# Altium schematic sheet Top.SchDoc
size A4; SheetNumber: 1; SheetTotal: 5
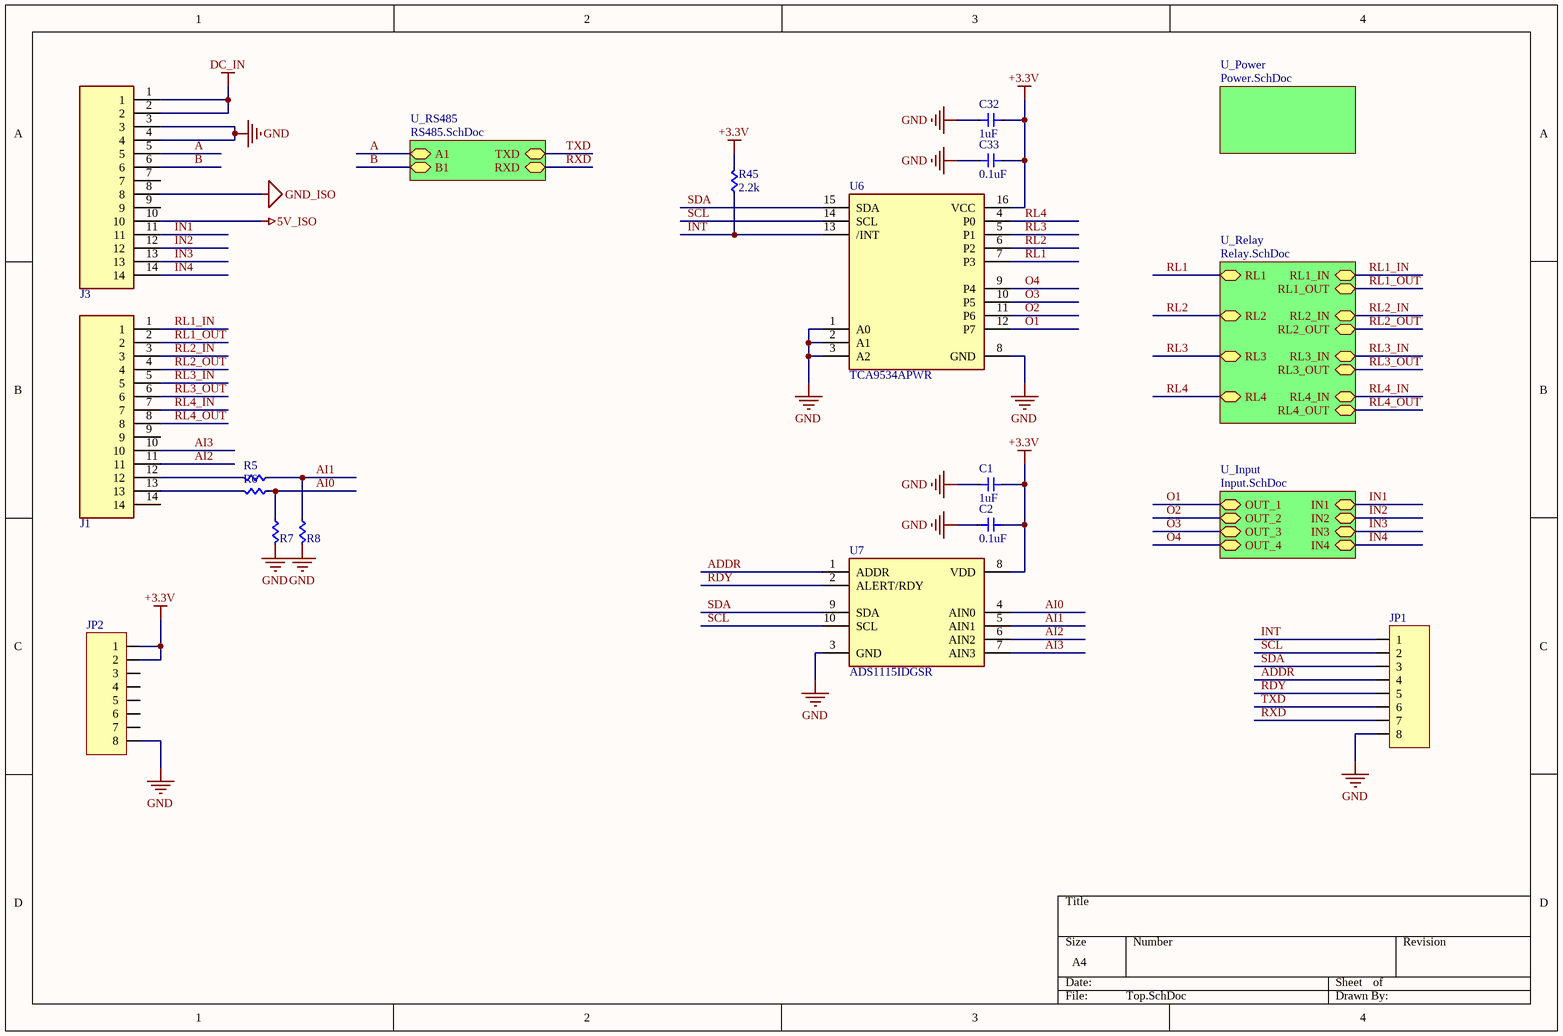
[diagram p0: Top.SchDoc]

## Parts
C1  1uF  [Cap 0603]
C2  0.1uF  [Cap 0603]
C32  1uF  [Cap 0603]
C33  0.1uF  [Cap 0603]
J1  CON 14 EDGR 3.81 RA  [CON 14 EDGR 3.81 RA]  (value not drawn)
J3  CON 14 EDGR 3.81 RA  [CON 14 EDGR 3.81 RA]  (value not drawn)
JP1  JP 1x8 2.54  [JP 1x8 DT]  (value not drawn)
JP2  JP 1x8 2.54  [JP 1x8 DT]  (value not drawn)
R5  RS1  [RES 0603]  (value not drawn)
R6  RS1  [RES 0603]  (value not drawn)
R7  RS2  [RES 0603]  (value not drawn)
R8  RS2  [RES 0603]  (value not drawn)
R45  2.2k  [RES 0603]
U6  TCA9534APWR  [SOP65P640X120-16N]
U7  ADS1115IDGSR  [SOP50P490X110-10N]

## Sub-sheets
U_Input = Input.SchDoc: IN4 (bidir), IN3 (bidir), IN2 (bidir), IN1 (bidir), OUT_1 (bidir), OUT_2 (bidir), OUT_3 (bidir), OUT_4 (bidir)
U_Power = Power.SchDoc: no entries
U_Relay = Relay.SchDoc: RL1 (bidir), RL1_OUT (bidir), RL1_IN (bidir), RL2 (bidir), RL2_OUT (bidir), RL3 (bidir), RL3_OUT (bidir), RL4 (bidir), RL4_OUT (bidir), RL4_IN (bidir), RL2_IN (bidir), RL3_IN (bidir)
U_RS485 = RS485.SchDoc: A1 (bidir), B1 (bidir), RXD (bidir), TXD (bidir)

## Nets
5V_ISO: J3.10
+3.3V: C1.1 C2.1 C32.1 C33.1 JP2.1 JP2.2 R45.2 U6.16(VCC) U7.8(VDD)
DC_IN: J3.1 J3.2
GND: C1.2 C2.2 C32.2 C33.2 J3.3 J3.4 JP1.8 JP2.8 R7.2 R8.2 U6.1(A0) U6.2(A1) U6.3(A2) U6.8(GND) U7.3(GND)
GND_ISO: J3.8
A: J3.5 ; sheet U_RS485/A1
ADDR: JP1.4 U7.1(ADDR)
AI0: R6.1 R7.1 U7.4(AIN0)
AI1: R5.1 R8.1 U7.5(AIN1)
AI2: J1.11 U7.6(AIN2)
AI3: J1.10 U7.7(AIN3)
B: J3.6 ; sheet U_RS485/B1
IN1: J3.11 ; sheet U_Input/IN1
IN2: J3.12 ; sheet U_Input/IN2
IN3: J3.13 ; sheet U_Input/IN3
IN4: J3.14 ; sheet U_Input/IN4
INT: JP1.1 R45.1 U6.13(/INT)
O1: U6.12(P7) ; sheet U_Input/OUT_1
O2: U6.11(P6) ; sheet U_Input/OUT_2
O3: U6.10(P5) ; sheet U_Input/OUT_3
O4: U6.9(P4) ; sheet U_Input/OUT_4
RDY: JP1.5 U7.2(ALERT/RDY)
RL1: U6.7(P3) ; sheet U_Relay/RL1
RL1_IN: J1.1 ; sheet U_Relay/RL1_IN
RL1_OUT: J1.2 ; sheet U_Relay/RL1_OUT
RL2: U6.6(P2) ; sheet U_Relay/RL2
RL2_IN: J1.3 ; sheet U_Relay/RL2_IN
RL2_OUT: J1.4 ; sheet U_Relay/RL2_OUT
RL3: U6.5(P1) ; sheet U_Relay/RL3
RL3_IN: J1.5 ; sheet U_Relay/RL3_IN
RL3_OUT: J1.6 ; sheet U_Relay/RL3_OUT
RL4: U6.4(P0) ; sheet U_Relay/RL4
RL4_IN: J1.7 ; sheet U_Relay/RL4_IN
RL4_OUT: J1.8 ; sheet U_Relay/RL4_OUT
RXD: JP1.7 ; sheet U_RS485/RXD
SCL: JP1.2 U6.14(SCL) U7.10(SCL)
SDA: JP1.3 U6.15(SDA) U7.9(SDA)
TXD: JP1.6 ; sheet U_RS485/TXD
NetJ1_12: J1.12 R5.2
NetJ1_13: J1.13 R6.2

Not connected (* = marked no-connect by the designer): J1 9 14; J3 7 9; JP2 3 4 5 6 7

## Library data of the parts
C1 C2 C32 C33 = Cap 0603: Capacitor SMD 0603
J1 J3 = CON 14 EDGR 3.81 RA: Pluggable,Receptacle, Horizontal, 3.81 Pitch, Terminal Block Connector; MF: {'manufacturer': u'Same Sky (Formerly CUI Devices)'}; MP: TBP02R1-381-14BE; Package: None; Price: None; Value: *; Availability: Unavailable
JP1 JP2 = JP 1x8 2.54 Duc Thang: Cắm; Ten_Linh_Kien: Jump Đơn Đực 2.54MM 1x40P Thẳng 11MM; Don_Vi: Con; Ma_Hang: MH000903; Ghi_Chu: *; Kieu_Chan: *; Chung_Loai: Cắm
R5-R8 R45 = RES 0603: RES SMD 0603; Manufacturer: Vishay Dale; Manufacturer Part Number: CRCW040210K0FKED; Resistance (Ohms): 10k; Tolerance: ±1%; Power (Watts): 0.063W, 1/16W; Temperature Coefficient: ±100ppm/°C; Supplier 1: Digi-Key; RoHS: RoHS Compliant; Category: Resistors; Stock 1: 2392462; Pricing 1: 10=0.083, 50=0.0444, 200=0.0255, 1000=0.0174 (USD); Packaging: Cut Tape (CT); Composition: Thick Film; Features: Automotive AEC-Q200; Operating Temperature: -55°C ~ 155°C; Package / Case: 0402 (1005 Metric); Supplier Device Package: 0402 (1005 Metric); Size / Dimension: 0.039" L x 0.020" W (1.00mm x 0.50mm); Height: 0.016" (0.40mm); Number of Terminations: 2; ComponentLink1URL: http://www.vishay.com/docs/20035/dcrcwe3.pdf; ComponentLink1Description: http://www.vishay.com/docs/20035/dcrcwe3.pdf; Supplier Part Number 1: 541-10.0KLCT-ND
U6 = TCA9534APWR: 8-bit 1.65- to 5.5-V I2C/SMBus I/O expander with interrupt, & config registers; MF: Texas Instruments; SnapEDA_Link: https://www.snapeda.com/parts/TCA9534APWR/Texas+Instruments/view-part/?ref=snap; Package: TSSOP-16 Texas Instruments; Value: *; MP: TCA9534APWR; Check_prices: https://www.snapeda.com/parts/TCA9534APWR/Texas+Instruments/view-part/?ref=eda
U7 = ADS1115IDGSR: 16-bit, 860-SPS, 4-channel, delta-sigma ADC with PGA, oscillator, VREF, comparator and I2C; MF: Texas Instruments; SnapEDA_Link: https://www.snapeda.com/parts/ADS1115IDGSR/Texas+Instruments/view-part/?ref=snap; Package: VSSOP-10 Texas Instruments; Value: *; MP: ADS1115IDGSR; Check_prices: https://www.snapeda.com/parts/ADS1115IDGSR/Texas+Instruments/view-part/?ref=eda